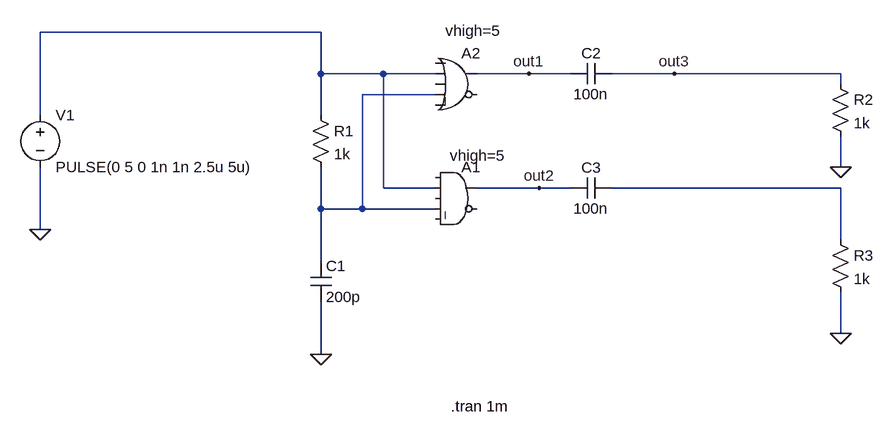
[diagram p0: schematic DeadTimeGeneratorSimulation.asc]
DeadTimeGeneratorSimulation.asc, the LTspice schematic file:
Version 4
SHEET 1 1064 680
WIRE 176 16 -256 16
WIRE 176 80 176 16
WIRE 272 80 176 80
WIRE 352 80 272 80
WIRE 496 80 416 80
WIRE 560 80 496 80
WIRE 720 80 624 80
WIRE 976 80 720 80
WIRE 976 96 976 80
WIRE 352 112 240 112
WIRE -256 144 -256 16
WIRE 176 144 176 80
WIRE 976 224 976 176
WIRE 272 256 272 80
WIRE 352 256 272 256
WIRE 512 256 416 256
WIRE 560 256 512 256
WIRE 976 256 624 256
WIRE 176 288 176 224
WIRE 240 288 240 112
WIRE 240 288 176 288
WIRE 352 288 240 288
WIRE -256 320 -256 224
WIRE 976 336 976 256
WIRE 176 368 176 288
WIRE 976 480 976 416
WIRE 176 512 176 432
FLAG 176 512 0
FLAG -256 320 0
FLAG 496 80 out1
FLAG 512 256 out2
FLAG 720 80 out3
FLAG 976 224 0
FLAG 976 480 0
SYMBOL voltage -256 128 R0
WINDOW 123 0 0 Left 0
WINDOW 39 0 0 Left 0
SYMATTR InstName V1
SYMATTR Value PULSE(0 5 0 1n 1n 2.5u 5u)
SYMBOL Digital\\and 384 208 R0
WINDOW 3 -9 -2 Left 2
SYMATTR Value vhigh=5
SYMATTR InstName A1
SYMBOL Digital\\or 384 32 R0
WINDOW 3 -16 -18 Left 2
SYMATTR Value vhigh=5
SYMATTR InstName A2
SYMBOL res 160 128 R0
SYMATTR InstName R1
SYMATTR Value 1k
SYMBOL cap 160 368 R0
SYMATTR InstName C1
SYMATTR Value 200p
SYMBOL cap 624 64 R90
WINDOW 0 0 32 VBottom 2
WINDOW 3 32 32 VTop 2
SYMATTR InstName C2
SYMATTR Value 100n
SYMBOL cap 624 240 R90
WINDOW 0 0 32 VBottom 2
WINDOW 3 32 32 VTop 2
SYMATTR InstName C3
SYMATTR Value 100n
SYMBOL res 960 80 R0
SYMATTR InstName R2
SYMATTR Value 1k
SYMBOL res 960 320 R0
SYMATTR InstName R3
SYMATTR Value 1k
TEXT 376 592 Left 2 !.tran 1m

The netlist it stands for:
* DeadTimeGeneratorSimulation.asc
V1 N001 0 PULSE(0 5 0 1n 1n 2.5u 5u)
A1 0 N001 0 N002 0 0 out2 0 AND vhigh=5
A2 0 N001 0 N002 0 0 out1 0 OR vhigh=5
R1 N001 N002 1k
C1 N002 0 200p
C2 out3 out1 100n
C3 N003 out2 100n
R2 out3 0 1k
R3 N003 0 1k
.tran 1m
.backanno
.end